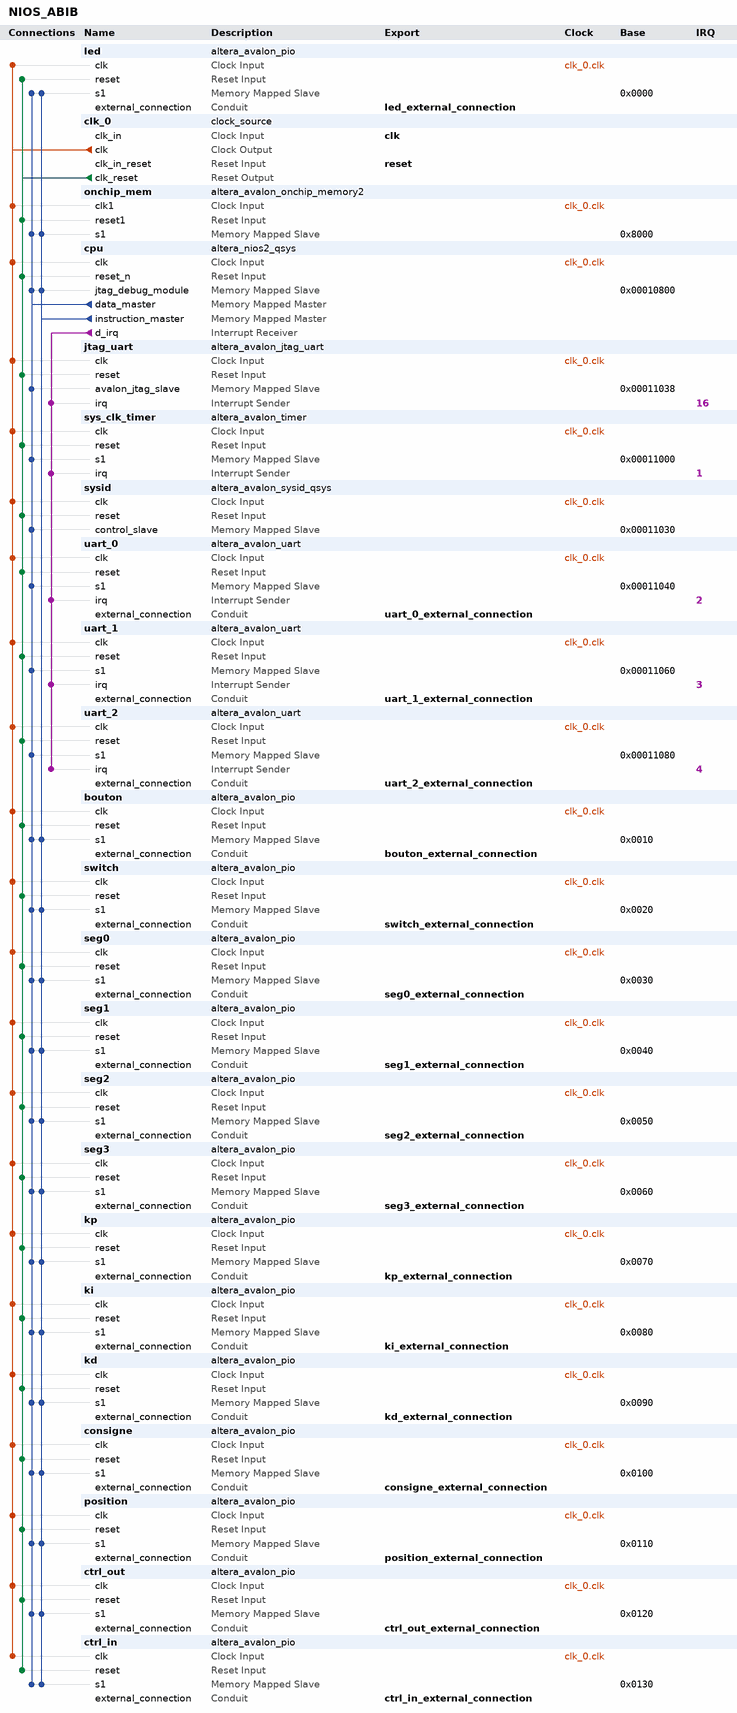
[diagram p0: system contents]
# Platform Designer (Qsys) system NIOS_ABIB, Cyclone III EP3C16F484C6
# Parameters at their usual value, and those the tool derives, are not listed.
package require -exact qsys 13.1
create_system NIOS_ABIB
set_project_property DEVICE_FAMILY {Cyclone III}
set_project_property DEVICE EP3C16F484C6

add_instance led altera_avalon_pio 13.1
set_instance_parameter_value led direction Output
set_instance_parameter_value led width 10

add_instance clk_0 clock_source 13.1
set_instance_parameter_value clk_0 clockFrequency 50000000

add_instance onchip_mem altera_avalon_onchip_memory2 13.1
set_instance_parameter_value onchip_mem dataWidth 32
set_instance_parameter_value onchip_mem dualPort false
set_instance_parameter_value onchip_mem initMemContent true
set_instance_parameter_value onchip_mem initializationFileName onchip_mem.hex
set_instance_parameter_value onchip_mem memorySize 20480

add_instance cpu altera_nios2_qsys 13.1
set_instance_parameter_value cpu resetSlave onchip_mem.s1
set_instance_parameter_value cpu mmu_TLBMissExcSlave None
set_instance_parameter_value cpu exceptionSlave onchip_mem.s1
set_instance_parameter_value cpu breakSlave cpu.jtag_debug_module
set_instance_parameter_value cpu muldiv_multiplierType NoneSmall
set_instance_parameter_value cpu impl Small
set_instance_parameter_value cpu icache_size 2048

add_instance jtag_uart altera_avalon_jtag_uart 13.1
set_instance_parameter_value jtag_uart simInteractiveOptions NO_INTERACTIVE_WINDOWS

add_instance sys_clk_timer altera_avalon_timer 13.1
set_instance_parameter_value sys_clk_timer period 1
set_instance_parameter_value sys_clk_timer periodUnits MSEC

add_instance sysid altera_avalon_sysid_qsys 13.1
set_instance_parameter_value sysid id 0

add_instance uart_0 altera_avalon_uart 13.1
set_instance_parameter_value uart_0 baud 115200
set_instance_parameter_value uart_0 dataBits 8
set_instance_parameter_value uart_0 fixedBaud true
set_instance_parameter_value uart_0 parity NONE
set_instance_parameter_value uart_0 stopBits 1

add_instance uart_1 altera_avalon_uart 13.1
set_instance_parameter_value uart_1 baud 115200
set_instance_parameter_value uart_1 dataBits 8
set_instance_parameter_value uart_1 fixedBaud true
set_instance_parameter_value uart_1 parity NONE
set_instance_parameter_value uart_1 stopBits 1

add_instance uart_2 altera_avalon_uart 13.1
set_instance_parameter_value uart_2 baud 115200
set_instance_parameter_value uart_2 dataBits 8
set_instance_parameter_value uart_2 fixedBaud true
set_instance_parameter_value uart_2 parity NONE
set_instance_parameter_value uart_2 stopBits 1

add_instance bouton altera_avalon_pio 13.1
set_instance_parameter_value bouton direction Input
set_instance_parameter_value bouton width 3

add_instance switch altera_avalon_pio 13.1
set_instance_parameter_value switch direction Input
set_instance_parameter_value switch width 10

add_instance seg0 altera_avalon_pio 13.1
set_instance_parameter_value seg0 direction Output
set_instance_parameter_value seg0 width 8

add_instance seg1 altera_avalon_pio 13.1
set_instance_parameter_value seg1 direction Output
set_instance_parameter_value seg1 width 8

add_instance seg2 altera_avalon_pio 13.1
set_instance_parameter_value seg2 direction Output
set_instance_parameter_value seg2 width 8

add_instance seg3 altera_avalon_pio 13.1
set_instance_parameter_value seg3 direction Output
set_instance_parameter_value seg3 width 8

add_instance kp altera_avalon_pio 13.1
set_instance_parameter_value kp direction Output
set_instance_parameter_value kp width 9

add_instance ki altera_avalon_pio 13.1
set_instance_parameter_value ki direction Output
set_instance_parameter_value ki width 9

add_instance kd altera_avalon_pio 13.1
set_instance_parameter_value kd direction Output
set_instance_parameter_value kd width 9

add_instance consigne altera_avalon_pio 13.1
set_instance_parameter_value consigne direction Output
set_instance_parameter_value consigne width 9

add_instance position altera_avalon_pio 13.1
set_instance_parameter_value position direction Input
set_instance_parameter_value position width 16

add_instance ctrl_out altera_avalon_pio 13.1
set_instance_parameter_value ctrl_out direction Output
set_instance_parameter_value ctrl_out width 8

add_instance ctrl_in altera_avalon_pio 13.1
set_instance_parameter_value ctrl_in direction Input
set_instance_parameter_value ctrl_in width 8

# connections
add_connection clk_0.clk bouton.clk clock
add_connection clk_0.clk consigne.clk clock
add_connection clk_0.clk cpu.clk clock
add_connection clk_0.clk ctrl_in.clk clock
add_connection clk_0.clk ctrl_out.clk clock
add_connection clk_0.clk jtag_uart.clk clock
add_connection clk_0.clk kd.clk clock
add_connection clk_0.clk ki.clk clock
add_connection clk_0.clk kp.clk clock
add_connection clk_0.clk led.clk clock
add_connection clk_0.clk onchip_mem.clk1 clock
add_connection clk_0.clk position.clk clock
add_connection clk_0.clk seg0.clk clock
add_connection clk_0.clk seg1.clk clock
add_connection clk_0.clk seg2.clk clock
add_connection clk_0.clk seg3.clk clock
add_connection clk_0.clk switch.clk clock
add_connection clk_0.clk sys_clk_timer.clk clock
add_connection clk_0.clk sysid.clk clock
add_connection clk_0.clk uart_0.clk clock
add_connection clk_0.clk uart_1.clk clock
add_connection clk_0.clk uart_2.clk clock
add_connection clk_0.clk_reset bouton.reset reset
add_connection clk_0.clk_reset consigne.reset reset
add_connection clk_0.clk_reset cpu.reset_n reset
add_connection clk_0.clk_reset ctrl_in.reset reset
add_connection clk_0.clk_reset ctrl_out.reset reset
add_connection clk_0.clk_reset jtag_uart.reset reset
add_connection clk_0.clk_reset kd.reset reset
add_connection clk_0.clk_reset ki.reset reset
add_connection clk_0.clk_reset kp.reset reset
add_connection clk_0.clk_reset led.reset reset
add_connection clk_0.clk_reset onchip_mem.reset1 reset
add_connection clk_0.clk_reset position.reset reset
add_connection clk_0.clk_reset seg0.reset reset
add_connection clk_0.clk_reset seg1.reset reset
add_connection clk_0.clk_reset seg2.reset reset
add_connection clk_0.clk_reset seg3.reset reset
add_connection clk_0.clk_reset switch.reset reset
add_connection clk_0.clk_reset sys_clk_timer.reset reset
add_connection clk_0.clk_reset sysid.reset reset
add_connection clk_0.clk_reset uart_0.reset reset
add_connection clk_0.clk_reset uart_1.reset reset
add_connection clk_0.clk_reset uart_2.reset reset
add_connection cpu.data_master bouton.s1 avalon
set_connection_parameter_value cpu.data_master/bouton.s1 baseAddress 0x0010
add_connection cpu.data_master consigne.s1 avalon
set_connection_parameter_value cpu.data_master/consigne.s1 baseAddress 0x0100
add_connection cpu.data_master cpu.jtag_debug_module avalon
set_connection_parameter_value cpu.data_master/cpu.jtag_debug_module baseAddress 0x00010800
add_connection cpu.data_master ctrl_in.s1 avalon
set_connection_parameter_value cpu.data_master/ctrl_in.s1 baseAddress 0x0130
add_connection cpu.data_master ctrl_out.s1 avalon
set_connection_parameter_value cpu.data_master/ctrl_out.s1 baseAddress 0x0120
add_connection cpu.data_master jtag_uart.avalon_jtag_slave avalon
set_connection_parameter_value cpu.data_master/jtag_uart.avalon_jtag_slave baseAddress 0x00011038
add_connection cpu.data_master kd.s1 avalon
set_connection_parameter_value cpu.data_master/kd.s1 baseAddress 0x0090
add_connection cpu.data_master ki.s1 avalon
set_connection_parameter_value cpu.data_master/ki.s1 baseAddress 0x0080
add_connection cpu.data_master kp.s1 avalon
set_connection_parameter_value cpu.data_master/kp.s1 baseAddress 0x0070
add_connection cpu.data_master led.s1 avalon
set_connection_parameter_value cpu.data_master/led.s1 baseAddress 0x0000
add_connection cpu.data_master onchip_mem.s1 avalon
set_connection_parameter_value cpu.data_master/onchip_mem.s1 baseAddress 0x8000
add_connection cpu.data_master position.s1 avalon
set_connection_parameter_value cpu.data_master/position.s1 baseAddress 0x0110
add_connection cpu.data_master seg0.s1 avalon
set_connection_parameter_value cpu.data_master/seg0.s1 baseAddress 0x0030
add_connection cpu.data_master seg1.s1 avalon
set_connection_parameter_value cpu.data_master/seg1.s1 baseAddress 0x0040
add_connection cpu.data_master seg2.s1 avalon
set_connection_parameter_value cpu.data_master/seg2.s1 baseAddress 0x0050
add_connection cpu.data_master seg3.s1 avalon
set_connection_parameter_value cpu.data_master/seg3.s1 baseAddress 0x0060
add_connection cpu.data_master switch.s1 avalon
set_connection_parameter_value cpu.data_master/switch.s1 baseAddress 0x0020
add_connection cpu.data_master sys_clk_timer.s1 avalon
set_connection_parameter_value cpu.data_master/sys_clk_timer.s1 baseAddress 0x00011000
add_connection cpu.data_master sysid.control_slave avalon
set_connection_parameter_value cpu.data_master/sysid.control_slave baseAddress 0x00011030
add_connection cpu.data_master uart_0.s1 avalon
set_connection_parameter_value cpu.data_master/uart_0.s1 baseAddress 0x00011040
add_connection cpu.data_master uart_1.s1 avalon
set_connection_parameter_value cpu.data_master/uart_1.s1 baseAddress 0x00011060
add_connection cpu.data_master uart_2.s1 avalon
set_connection_parameter_value cpu.data_master/uart_2.s1 baseAddress 0x00011080
add_connection cpu.instruction_master bouton.s1 avalon
set_connection_parameter_value cpu.instruction_master/bouton.s1 baseAddress 0x0010
add_connection cpu.instruction_master consigne.s1 avalon
set_connection_parameter_value cpu.instruction_master/consigne.s1 baseAddress 0x0100
add_connection cpu.instruction_master cpu.jtag_debug_module avalon
set_connection_parameter_value cpu.instruction_master/cpu.jtag_debug_module baseAddress 0x00010800
add_connection cpu.instruction_master ctrl_in.s1 avalon
set_connection_parameter_value cpu.instruction_master/ctrl_in.s1 baseAddress 0x0130
add_connection cpu.instruction_master ctrl_out.s1 avalon
set_connection_parameter_value cpu.instruction_master/ctrl_out.s1 baseAddress 0x0120
add_connection cpu.instruction_master kd.s1 avalon
set_connection_parameter_value cpu.instruction_master/kd.s1 baseAddress 0x0090
add_connection cpu.instruction_master ki.s1 avalon
set_connection_parameter_value cpu.instruction_master/ki.s1 baseAddress 0x0080
add_connection cpu.instruction_master kp.s1 avalon
set_connection_parameter_value cpu.instruction_master/kp.s1 baseAddress 0x0070
add_connection cpu.instruction_master led.s1 avalon
set_connection_parameter_value cpu.instruction_master/led.s1 baseAddress 0x0000
add_connection cpu.instruction_master onchip_mem.s1 avalon
set_connection_parameter_value cpu.instruction_master/onchip_mem.s1 baseAddress 0x8000
add_connection cpu.instruction_master position.s1 avalon
set_connection_parameter_value cpu.instruction_master/position.s1 baseAddress 0x0110
add_connection cpu.instruction_master seg0.s1 avalon
set_connection_parameter_value cpu.instruction_master/seg0.s1 baseAddress 0x0030
add_connection cpu.instruction_master seg1.s1 avalon
set_connection_parameter_value cpu.instruction_master/seg1.s1 baseAddress 0x0040
add_connection cpu.instruction_master seg2.s1 avalon
set_connection_parameter_value cpu.instruction_master/seg2.s1 baseAddress 0x0050
add_connection cpu.instruction_master seg3.s1 avalon
set_connection_parameter_value cpu.instruction_master/seg3.s1 baseAddress 0x0060
add_connection cpu.instruction_master switch.s1 avalon
set_connection_parameter_value cpu.instruction_master/switch.s1 baseAddress 0x0020
add_connection cpu.d_irq jtag_uart.irq interrupt
set_connection_parameter_value cpu.d_irq/jtag_uart.irq irqNumber 16
add_connection cpu.d_irq sys_clk_timer.irq interrupt
set_connection_parameter_value cpu.d_irq/sys_clk_timer.irq irqNumber 1
add_connection cpu.d_irq uart_0.irq interrupt
set_connection_parameter_value cpu.d_irq/uart_0.irq irqNumber 2
add_connection cpu.d_irq uart_1.irq interrupt
set_connection_parameter_value cpu.d_irq/uart_1.irq irqNumber 3
add_connection cpu.d_irq uart_2.irq interrupt
set_connection_parameter_value cpu.d_irq/uart_2.irq irqNumber 4

# exported interfaces
add_interface clk clock sink
set_interface_property clk EXPORT_OF clk_0.clk_in
add_interface reset reset sink
set_interface_property reset EXPORT_OF clk_0.clk_in_reset
add_interface uart_2_external_connection conduit end
set_interface_property uart_2_external_connection EXPORT_OF uart_2.external_connection
add_interface uart_0_external_connection conduit end
set_interface_property uart_0_external_connection EXPORT_OF uart_0.external_connection
add_interface uart_1_external_connection conduit end
set_interface_property uart_1_external_connection EXPORT_OF uart_1.external_connection
add_interface led_external_connection conduit end
set_interface_property led_external_connection EXPORT_OF led.external_connection
add_interface bouton_external_connection conduit end
set_interface_property bouton_external_connection EXPORT_OF bouton.external_connection
add_interface switch_external_connection conduit end
set_interface_property switch_external_connection EXPORT_OF switch.external_connection
add_interface seg0_external_connection conduit end
set_interface_property seg0_external_connection EXPORT_OF seg0.external_connection
add_interface seg1_external_connection conduit end
set_interface_property seg1_external_connection EXPORT_OF seg1.external_connection
add_interface seg2_external_connection conduit end
set_interface_property seg2_external_connection EXPORT_OF seg2.external_connection
add_interface seg3_external_connection conduit end
set_interface_property seg3_external_connection EXPORT_OF seg3.external_connection
add_interface kp_external_connection conduit end
set_interface_property kp_external_connection EXPORT_OF kp.external_connection
add_interface ki_external_connection conduit end
set_interface_property ki_external_connection EXPORT_OF ki.external_connection
add_interface kd_external_connection conduit end
set_interface_property kd_external_connection EXPORT_OF kd.external_connection
add_interface consigne_external_connection conduit end
set_interface_property consigne_external_connection EXPORT_OF consigne.external_connection
add_interface position_external_connection conduit end
set_interface_property position_external_connection EXPORT_OF position.external_connection
add_interface ctrl_out_external_connection conduit end
set_interface_property ctrl_out_external_connection EXPORT_OF ctrl_out.external_connection
add_interface ctrl_in_external_connection conduit end
set_interface_property ctrl_in_external_connection EXPORT_OF ctrl_in.external_connection

set_interconnect_requirement {$system} qsys_mm.clockCrossingAdapter HANDSHAKE
set_interconnect_requirement {$system} qsys_mm.maxAdditionalLatency 1
set_interconnect_requirement {$system} qsys_mm.insertDefaultSlave false

save_system NIOS_ABIB.qsys
